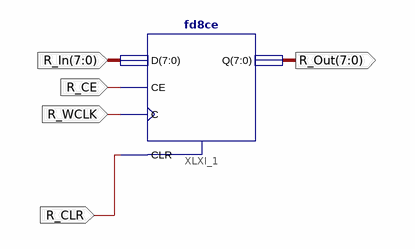
[diagram p0: schematic sheet 1]
// Xilinx ISE schematic Register_8bit.sch (spartan3e) as structural Verilog: 1 symbols, 5 ports
module Register_8bit (
  input  [7:0] R_In,
  input  R_CE,
  input  R_WCLK,
  input  R_CLR,
  output [7:0] R_Out
);

  fd8ce XLXI_1 (.C(R_WCLK), .CE(R_CE), .CLR(R_CLR), .D(R_In), .Q(R_Out));
endmodule
